# Altium schematic sheet Project_Overview.SchDoc: Project overview
size A4; Date: Not used; ApprovedBy: Not used; CheckedBy: Not used; Author: Not used; CompanyName: STMicroelectronics; DrawnBy: Not used; Engineer: Not used; Organization: Not used; Address1: Not used; Address2: Not used; Address3: Not used; Address4: Not used; DocumentNumber: MB1191; Revision: Not used; SheetNumber: 1; SheetTotal: 14; CurrentTime: Not used; CurrentDate: Not used; Time: Not used; DocumentFullPathAndName: Not used; DocumentName: Not used; ModifiedDate: Not used; ImagePath: Not used; ProjectName: Not used; Application_BuildNumber: Not used
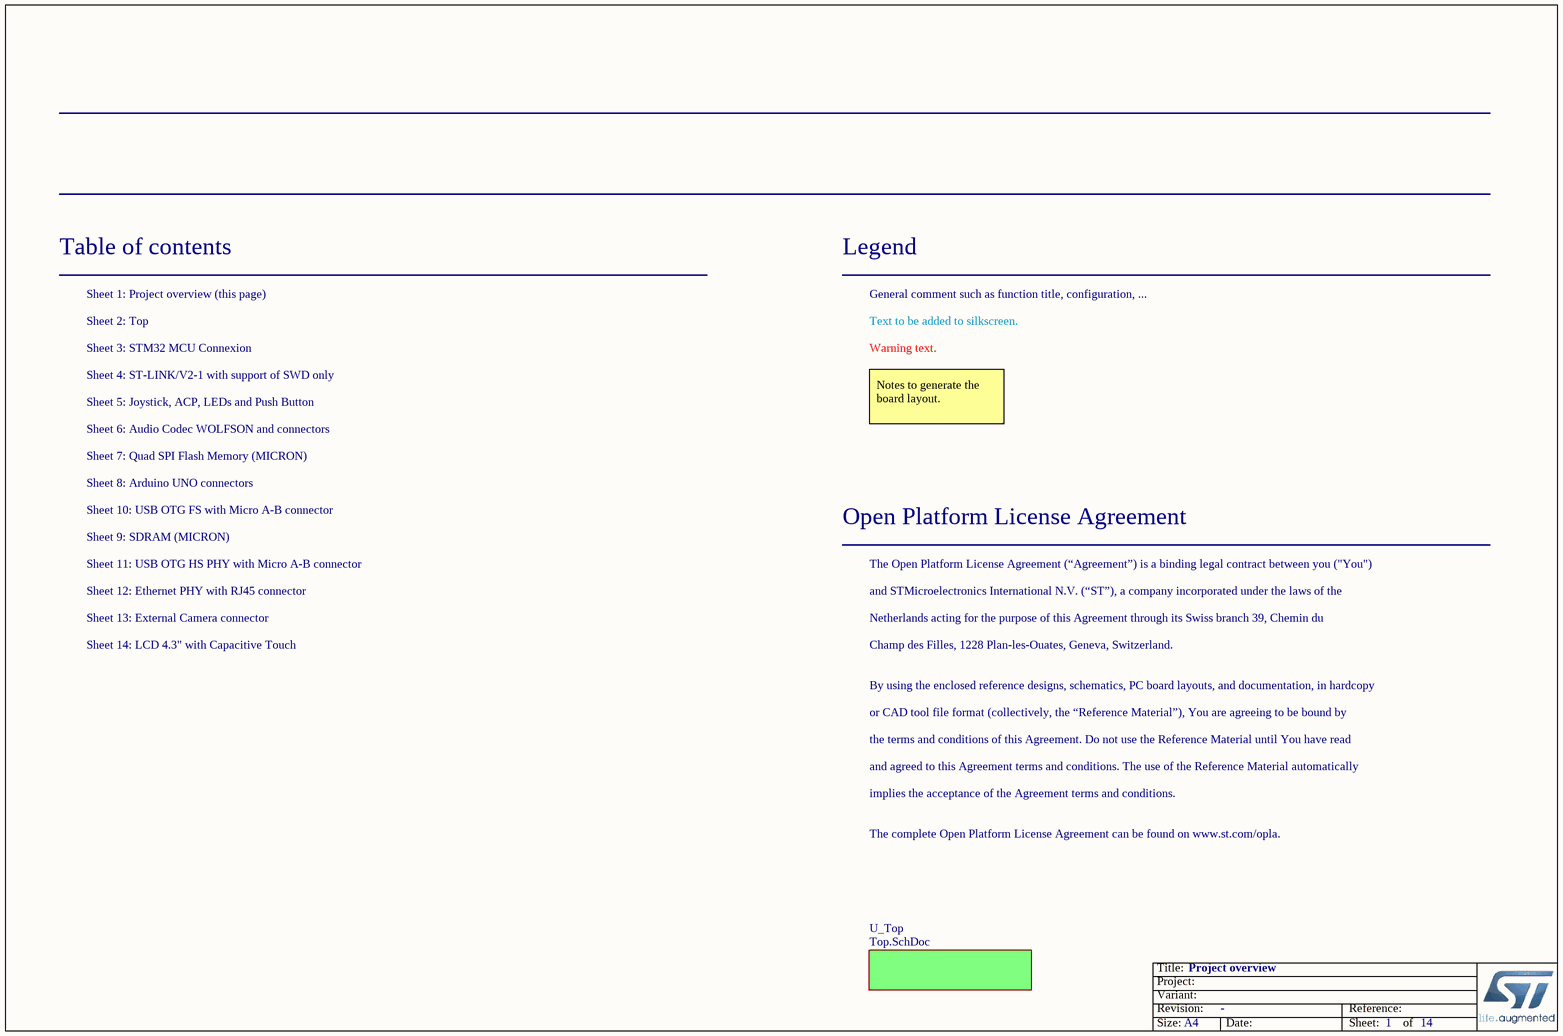
[diagram p0: Project_Overview.SchDoc]

## Sub-sheets
U_Top = Top.SchDoc: no entries

## Notes on the sheet
- Table of contents
- Sheet 1: Project overview (this page)
- Legend
- General comment such as function title, configuration, ...
- Sheet 2: Top
- Sheet 4: ST-LINK/V2-1 with support of SWD only
- Sheet 3: STM32 MCU Connexion
- Text to be added to silkscreen.
- Warning text.
- Sheet 5: Joystick, ACP, LEDs and Push Button
- Sheet 6: Audio Codec WOLFSON and connectors
- Notes to generate the board layout.
- Sheet 8: Arduino UNO connectors
- Sheet 10: USB OTG FS with Micro A-B connector
- Sheet 7: Quad SPI Flash Memory (MICRON)
- Sheet 9: SDRAM (MICRON)
- Sheet 11: USB OTG HS PHY with Micro A-B connector
- Open Platform License Agreement
- The Open Platform License Agreement (“Agreement”) is a binding legal contract between you ("You")
- Sheet 12: Ethernet PHY with RJ45 connector
- Sheet 13: External Camera connector
- Sheet 14: LCD 4.3" with Capacitive Touch
- and STMicroelectronics International N.V. (“ST”), a company incorporated under the laws of the
- Netherlands acting for the purpose of this Agreement through its Swiss branch 39, Chemin du
- Champ des Filles, 1228 Plan-les-Ouates, Geneva, Switzerland.
- By using the enclosed reference designs, schematics, PC board layouts, and documentation, in hardcopy
- or CAD tool file format (collectively, the “Reference Material”), You are agreeing to be bound by
- the terms and conditions of this Agreement. Do not use the Reference Material until You have read
- and agreed to this Agreement terms and conditions. The use of the Reference Material automatically
- implies the acceptance of the Agreement terms and conditions.
- The complete Open Platform License Agreement can be found on www.st.com/opla.
- Title:
- Project:
- Size:
- Revision:
- Variant:
- A4
- -
- Date:
- Reference:
- Sheet:
- of